# Altium schematic sheet Sheet2.SchDoc
size A4; SheetNumber: 1; SheetTotal: 1
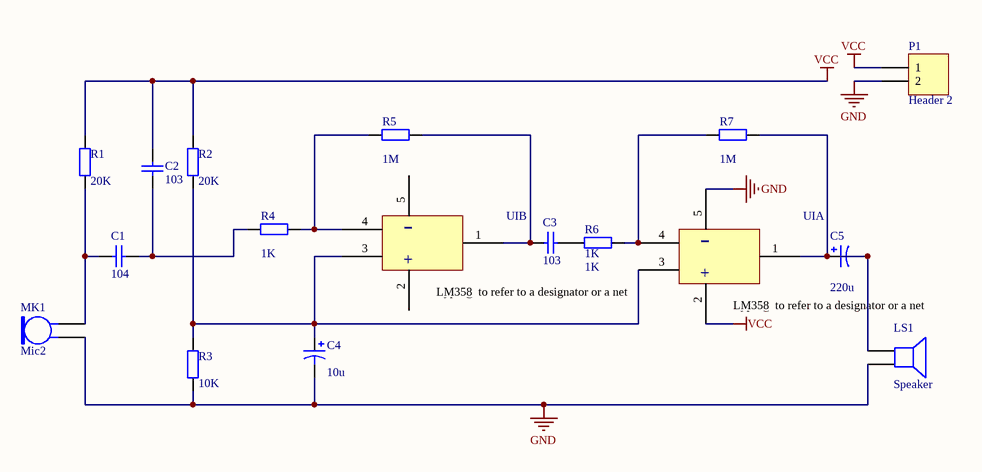
[diagram p0: Sheet2.SchDoc]

## Parts
C1  104  [RAD-0.3]
C2  103  [RAD-0.3]
C3  103  [RAD-0.3]
C4  value 10u  [RB7.6-15]  (hidden comment: Cap Pol1)
C5  value 220u  [RB7.6-15]  (hidden comment: Cap Pol1)
LS1  Speaker  [PIN2]
MK1  Mic2  [PIN2]
P1  Header 2  [HDR1X2]
R1  value 20K  [AXIAL-0.4]  (hidden comment: Res2)
R2  value 20K  [AXIAL-0.4]  (hidden comment: Res2)
R3  value 10K  [AXIAL-0.4]  (hidden comment: Res2)
R4  value 1K  [AXIAL-0.4]  (hidden comment: Res2)
R5  value 1M  [AXIAL-0.4]  (hidden comment: Res2)
R6  1K  [AXIAL-0.4]
R7  value 1M  [AXIAL-0.4]  (hidden comment: Res2)
UIA  双运算放大器  [LM358]  (value not drawn)
UIB  双运算放大器  [LM358]  (value not drawn)

## Nets
GND: C4.2 LS1.2 MK1.1 P1.2 R3.2 UIA.5(GND)
VCC: C2.2 P1.1 R1.2 R2.2 UIA.2
NetC1_1: C1.1 MK1.2 R1.1
NetC1_2: C1.2 C2.1 R4.2
NetC3_1: C3.1 R5.1 UIB.1
NetC3_2: C3.2 R6.1
NetC4_1: C4.1 R2.1 R3.1 UIA.3 UIB.3
NetC5_1: C5.1 R7.2 UIA.1
NetC5_2: C5.2 LS1.1
NetR4_1: R4.1 R5.2 UIB.4
NetR6_2: R6.2 R7.1 UIA.4

Not connected (* = marked no-connect by the designer): UIB 2(22) 5(GND)

## Notes on the sheet
- (in symbol 放大器) -; +; Type @ to refer to a designator or a net; LM358

## Library data of the parts
C1-C3 = Cap: Capacitor; Value: 100pF; Published: 8-Jun-2000; LatestRevisionDate: 17-Jul-2002; LatestRevisionNote: Re-released for DXP Platform.; PackageReference: RAD-0.3; Publisher: Altium Limited; PackageDescription: Radial Cap, Thru-Hole; 2 Leads; 0.3 in Pin Spacing
C4 C5 = Cap Pol1: Polarized Capacitor (Radial); Published: 8-Jun-2000; LatestRevisionDate: 17-Jul-2002; LatestRevisionNote: Re-released for DXP Platform.; PackageReference: RB7.6-15; Publisher: Altium Limited; PackageDescription: Polarized Capacitor (Radial); 2 Leads
LS1 = Speaker: Loudspeaker; Published: 24-Mar-1999; LatestRevisionDate: 17-Jul-2002; LatestRevisionNote: Re-released for DXP Platform.; PackageReference: PIN2; Publisher: Altium Limited
MK1 = Mic2: Microphone; Published: 24-Mar-1999; LatestRevisionDate: 17-Jul-2002; LatestRevisionNote: Re-released for DXP Platform.; PackageReference: PIN2; Publisher: Altium Limited
P1 = Header 2: Header, 2-Pin; LatestRevisionDate: 17-Jul-2002; LatestRevisionNote: Re-released for DXP Platform.; Publisher: Altium Limited
R1-R7 = Res2: Resistor; Published: 8-Jun-2000; LatestRevisionDate: 17-Jul-2002; LatestRevisionNote: Re-released for DXP Platform.; PackageReference: AXIAL-0.4; Publisher: Altium Limited; PackageDescription: Axial Device, Thru-Hole; 2 Leads; 0.4 in Pin Spacing
  R6: Value: 1K
UIA UIB = 放大器